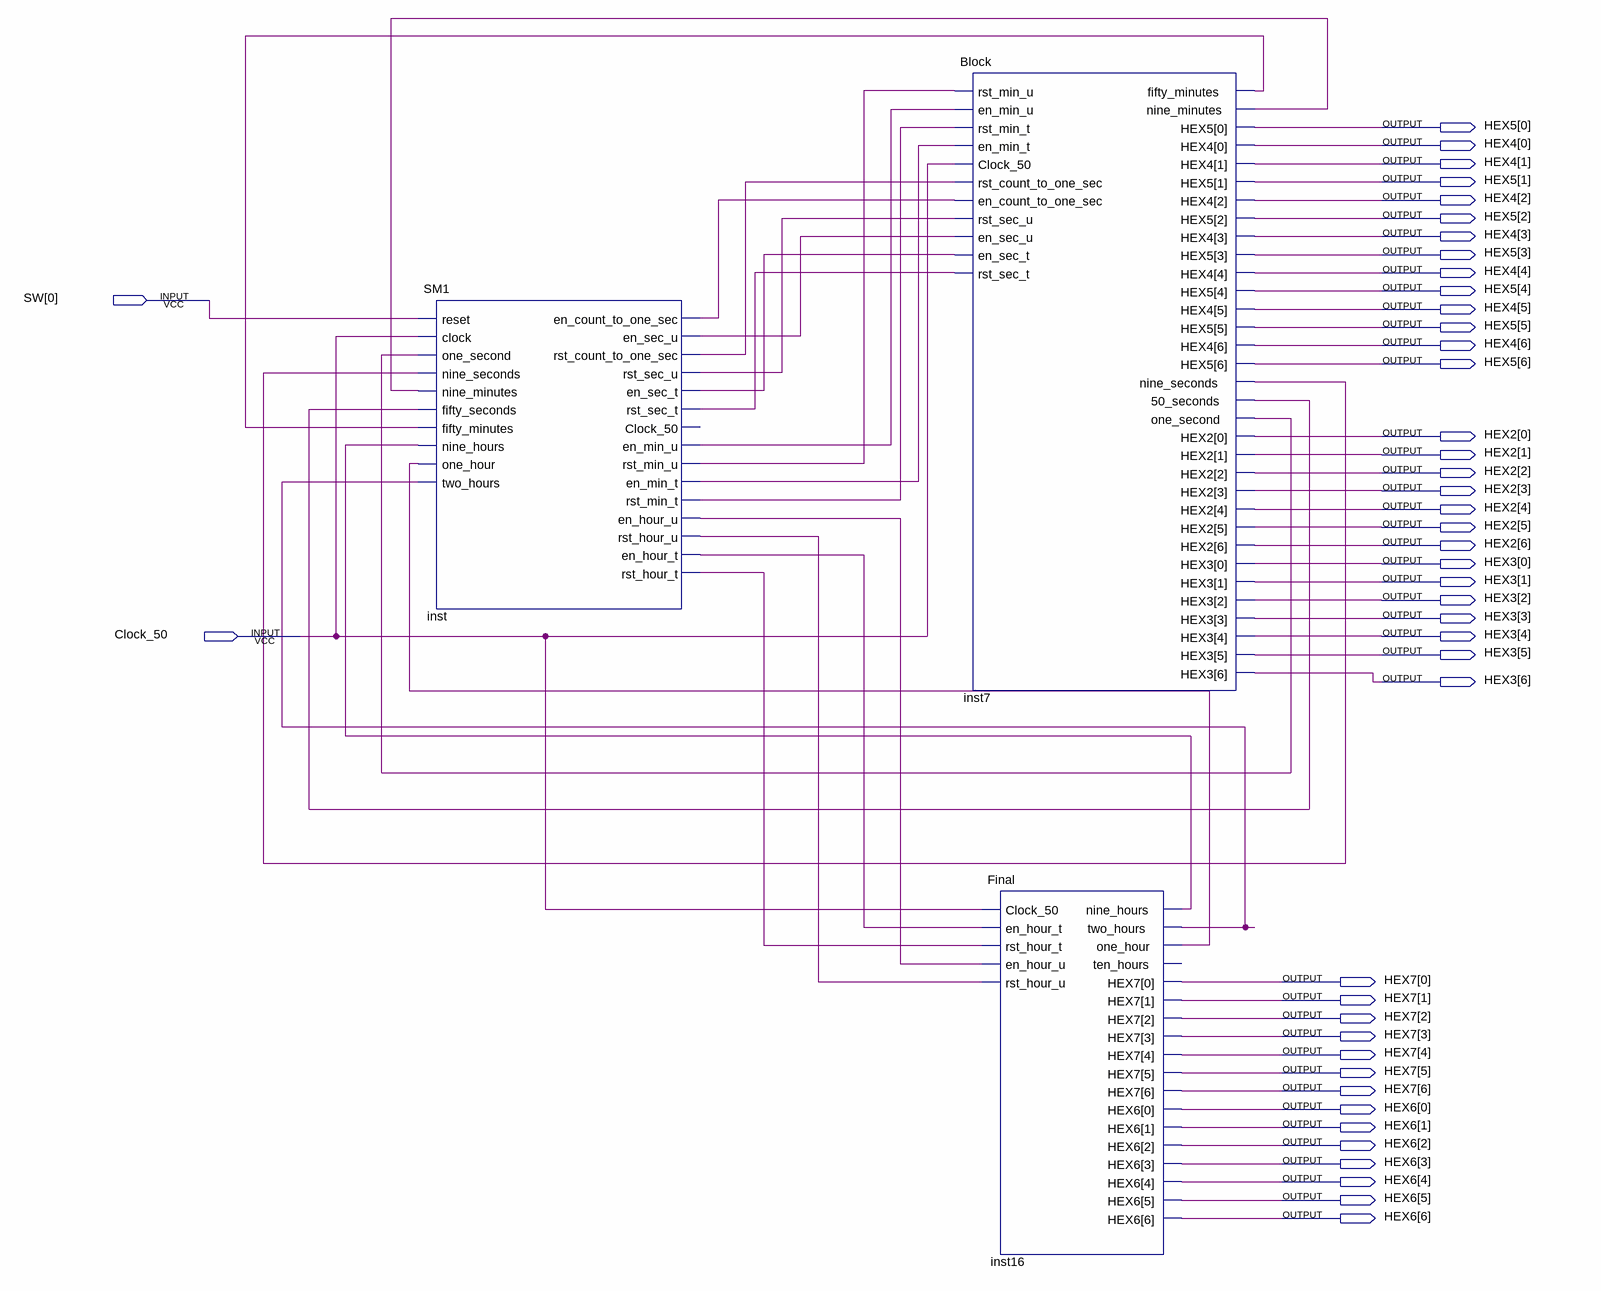
[diagram p0: schematic sheet]
// Quartus schematic Block2.bdf as structural Verilog: 3 symbols, 44 pins
module Block2 (
  input  [0:0] SW,
  input  Clock_50,
  output [6:0] HEX5,
  output [6:0] HEX4,
  output [6:0] HEX2,
  output [6:0] HEX3,
  output [6:0] HEX7,
  output [6:0] HEX6
);

  wire inst7_50_seconds, inst7_fifty_minutes, inst7_nine_minutes, inst7_nine_seconds, inst7_one_second,
       inst16_nine_hours, inst16_one_hour, inst16_two_hours, inst_en_count_to_one_sec, inst_en_hour_t,
       inst_en_hour_u, inst_en_min_t, inst_en_min_u, inst_en_sec_t, inst_en_sec_u, inst_rst_count_to_one_sec,
       inst_rst_hour_t, inst_rst_hour_u, inst_rst_min_t, inst_rst_min_u, inst_rst_sec_t, inst_rst_sec_u;

  SM1 inst (
    .reset(SW[0]), .clock(Clock_50), .one_second(inst7_one_second), .nine_seconds(inst7_nine_seconds),
    .nine_minutes(inst7_nine_minutes), .fifty_seconds(inst7_50_seconds), .fifty_minutes(inst7_fifty_minutes),
    .nine_hours(inst16_nine_hours), .one_hour(inst16_one_hour), .two_hours(inst16_two_hours),
    .en_count_to_one_sec(inst_en_count_to_one_sec), .en_sec_u(inst_en_sec_u),
    .rst_count_to_one_sec(inst_rst_count_to_one_sec), .rst_sec_u(inst_rst_sec_u), .en_sec_t(inst_en_sec_t),
    .rst_sec_t(inst_rst_sec_t), .en_min_u(inst_en_min_u), .rst_min_u(inst_rst_min_u),
    .en_min_t(inst_en_min_t), .rst_min_t(inst_rst_min_t), .en_hour_u(inst_en_hour_u),
    .rst_hour_u(inst_rst_hour_u), .en_hour_t(inst_en_hour_t), .rst_hour_t(inst_rst_hour_t));  // open: Clock_50
  Block inst7 (
    .rst_min_u(inst_rst_min_u), .en_min_u(inst_en_min_u), .rst_min_t(inst_rst_min_t),
    .en_min_t(inst_en_min_t), .Clock_50(Clock_50), .rst_count_to_one_sec(inst_rst_count_to_one_sec),
    .en_count_to_one_sec(inst_en_count_to_one_sec), .rst_sec_u(inst_rst_sec_u), .en_sec_u(inst_en_sec_u),
    .en_sec_t(inst_en_sec_t), .rst_sec_t(inst_rst_sec_t), .fifty_minutes(inst7_fifty_minutes),
    .nine_minutes(inst7_nine_minutes), .HEX5(HEX5), .HEX4(HEX4), .nine_seconds(inst7_nine_seconds),
    .\50_seconds (inst7_50_seconds), .one_second(inst7_one_second), .HEX2(HEX2), .HEX3(HEX3));
  Final inst16 (
    .Clock_50(Clock_50), .en_hour_t(inst_en_hour_t), .rst_hour_t(inst_rst_hour_t),
    .en_hour_u(inst_en_hour_u), .rst_hour_u(inst_rst_hour_u), .nine_hours(inst16_nine_hours),
    .two_hours(inst16_two_hours), .one_hour(inst16_one_hour), .HEX7(HEX7), .HEX6(HEX6));  // open: ten_hours
endmodule
